# Altium schematic sheet Power_Supply.SchDoc
size A4; SheetNumber: 4; SheetTotal: 18
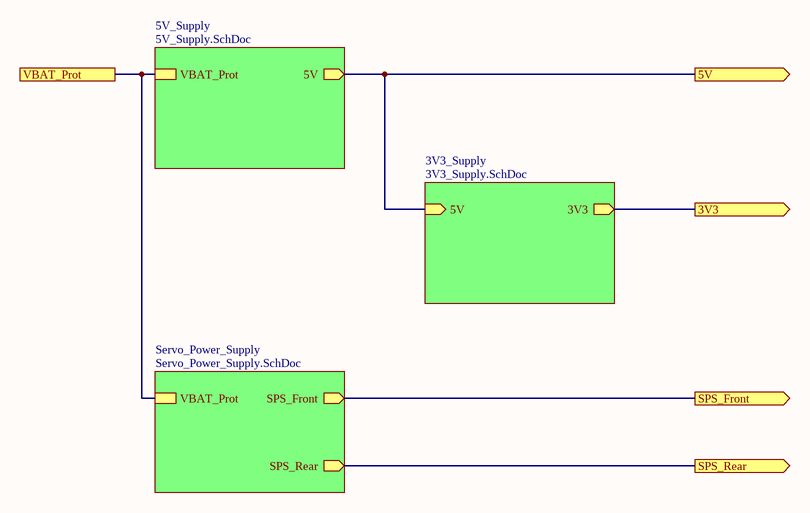
[diagram p0: Power_Supply.SchDoc]

## Sub-sheets
3V3_Supply = 3V3_Supply.SchDoc: 5V (in), 3V3 (out)
5V_Supply = 5V_Supply.SchDoc: VBAT_Prot, 5V (out)
Servo_Power_Supply = Servo_Power_Supply.SchDoc: VBAT_Prot, SPS_Front (out), SPS_Rear (out)

## Ports
3V3 (out), 5V (out), SPS_Front (out), SPS_Rear (out), VBAT_Prot

## Nets
3V3: port 3V3, sheet 3V3_Supply/3V3
5V: port 5V, sheet 5V_Supply/5V, sheet 3V3_Supply/5V
SPS_Front: port SPS_Front, sheet Servo_Power_Supply/SPS_Front
SPS_Rear: port SPS_Rear, sheet Servo_Power_Supply/SPS_Rear
VBAT_Prot: port VBAT_Prot, sheet 5V_Supply/VBAT_Prot, sheet Servo_Power_Supply/VBAT_Prot